# EasyEDA schematic SCH_Bike-Helmet-Turn-Signals_2024-05-09.json

## Sheets
1 Sheet_1: TITLE: Bike Side; REV: 1.0; Date: 2024-05-04; Sheet: 1/2; Drawn By: Zach Hennen; Company: UW Madison
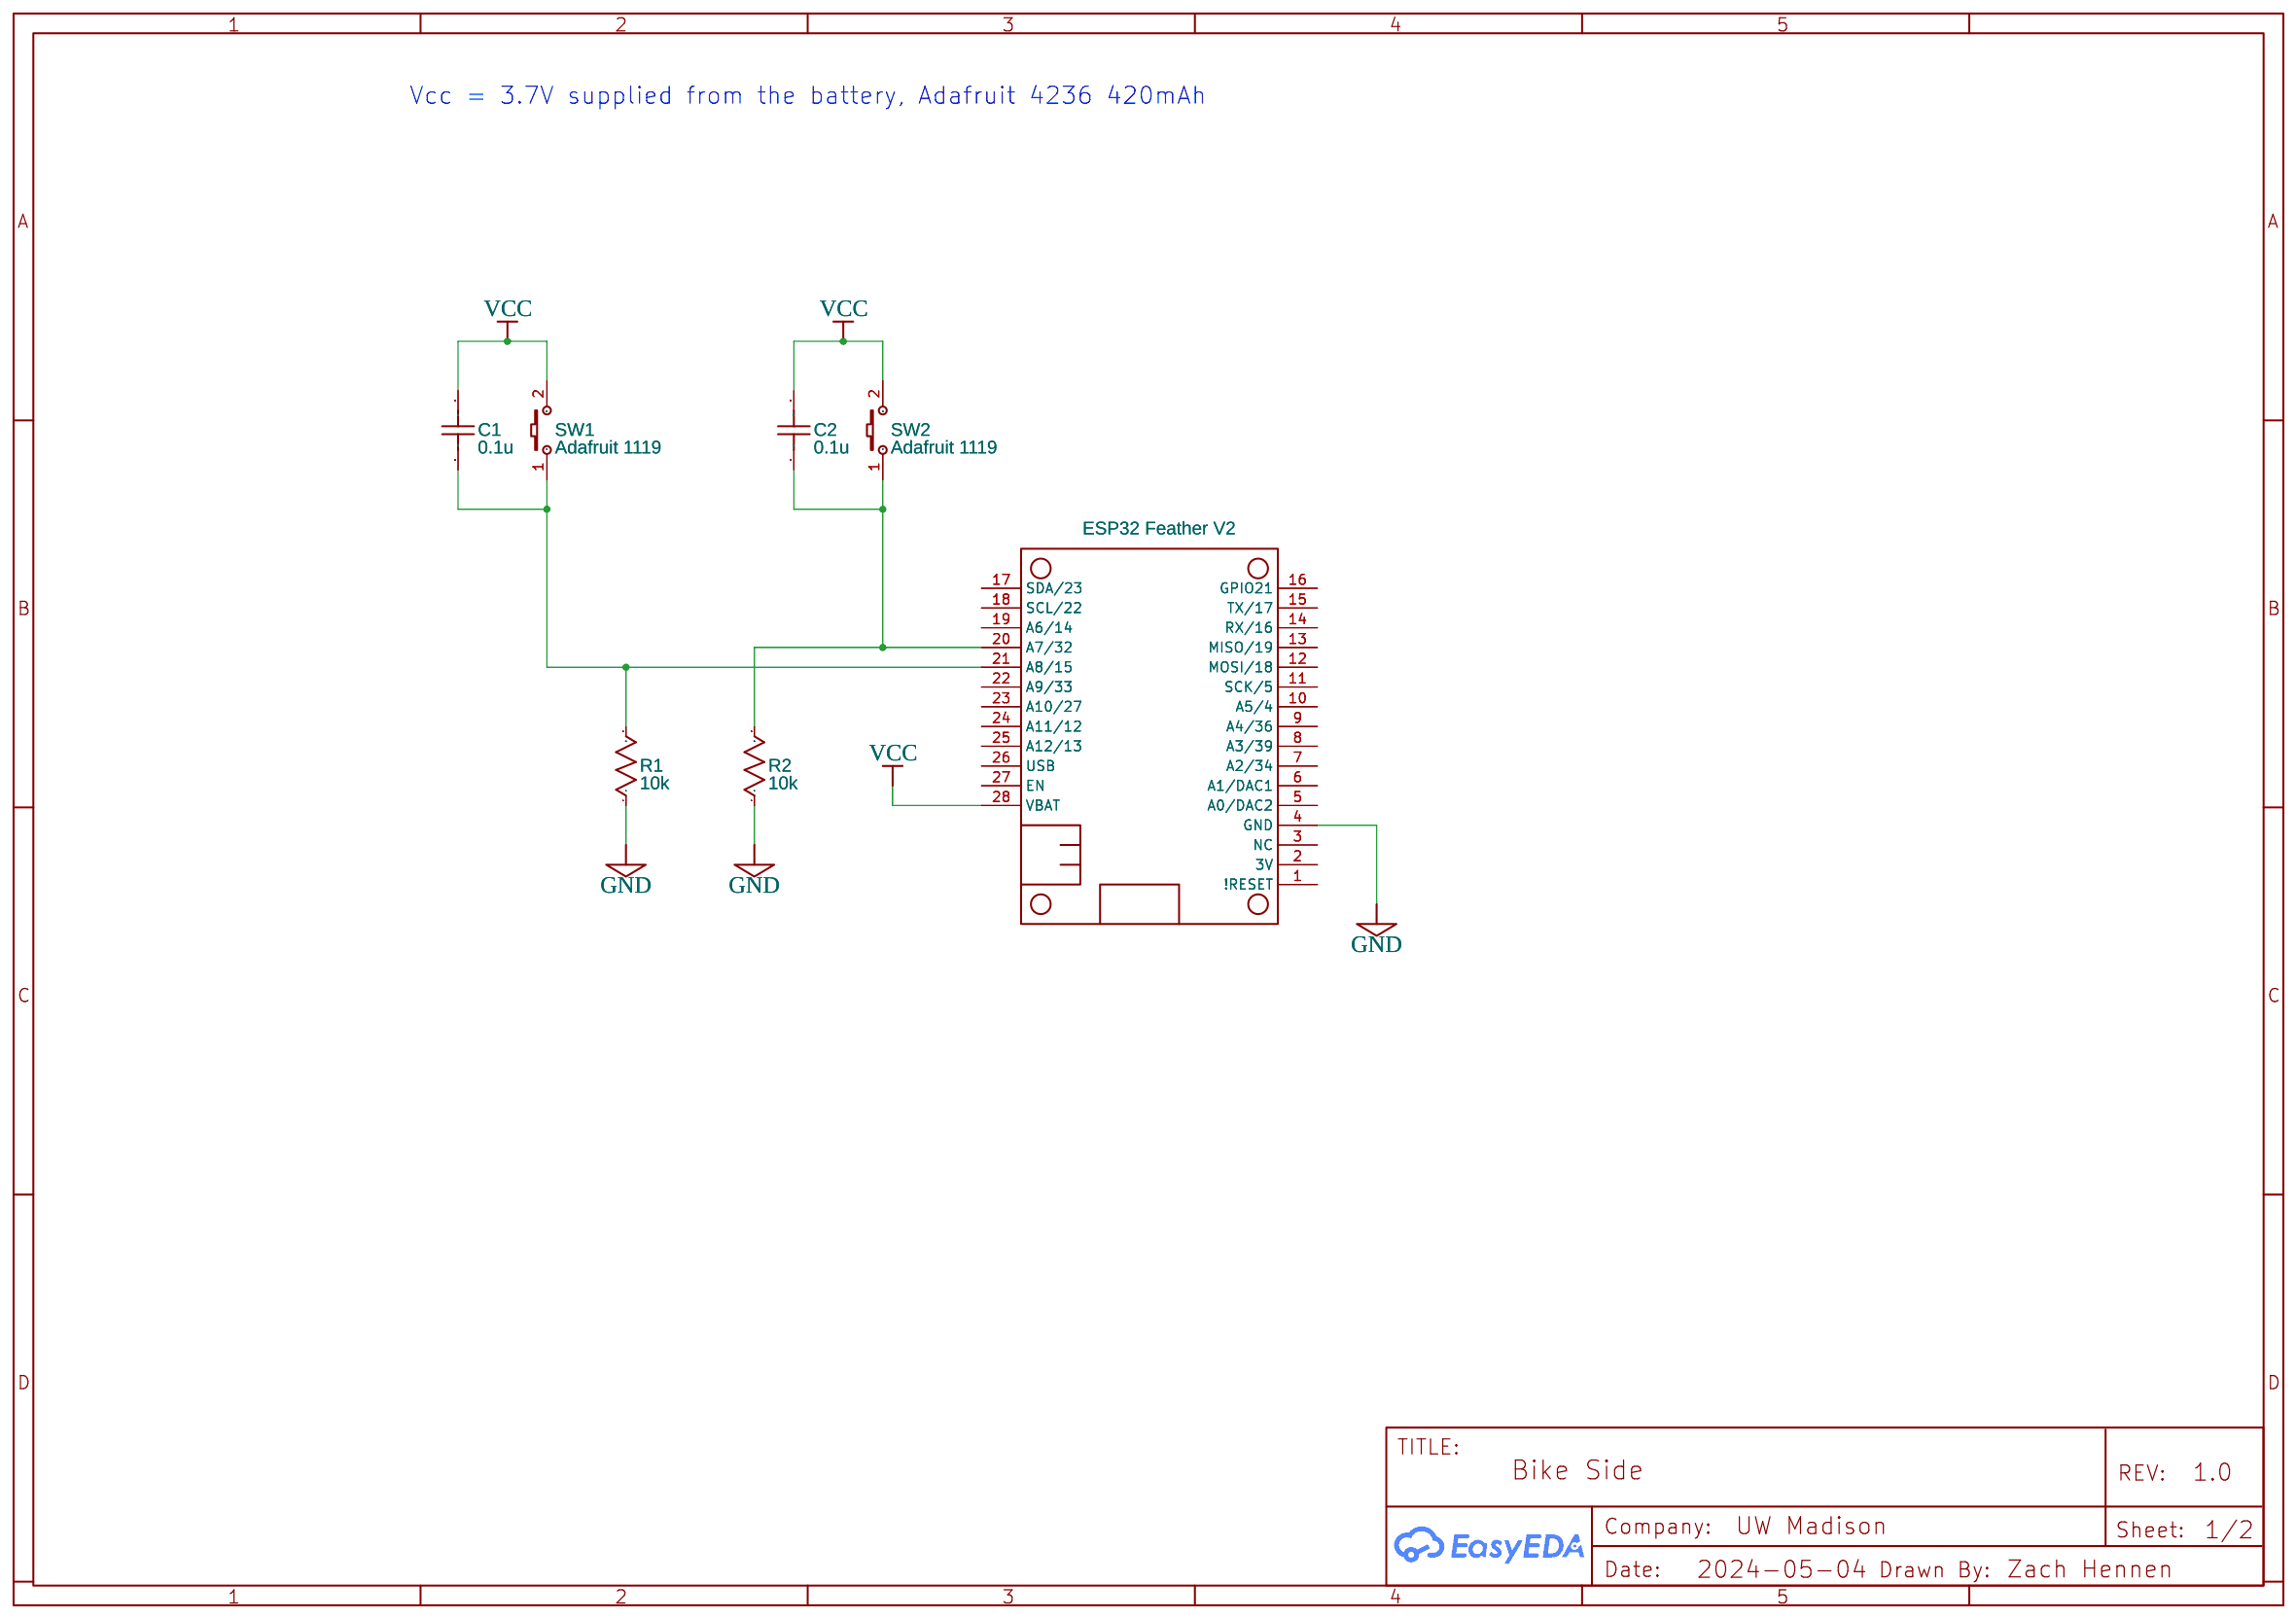
[diagram p0: Sheet_1]
2 Sheet_2: TITLE: Helmet Side; Date: 2024-05-06; Sheet: 2/2
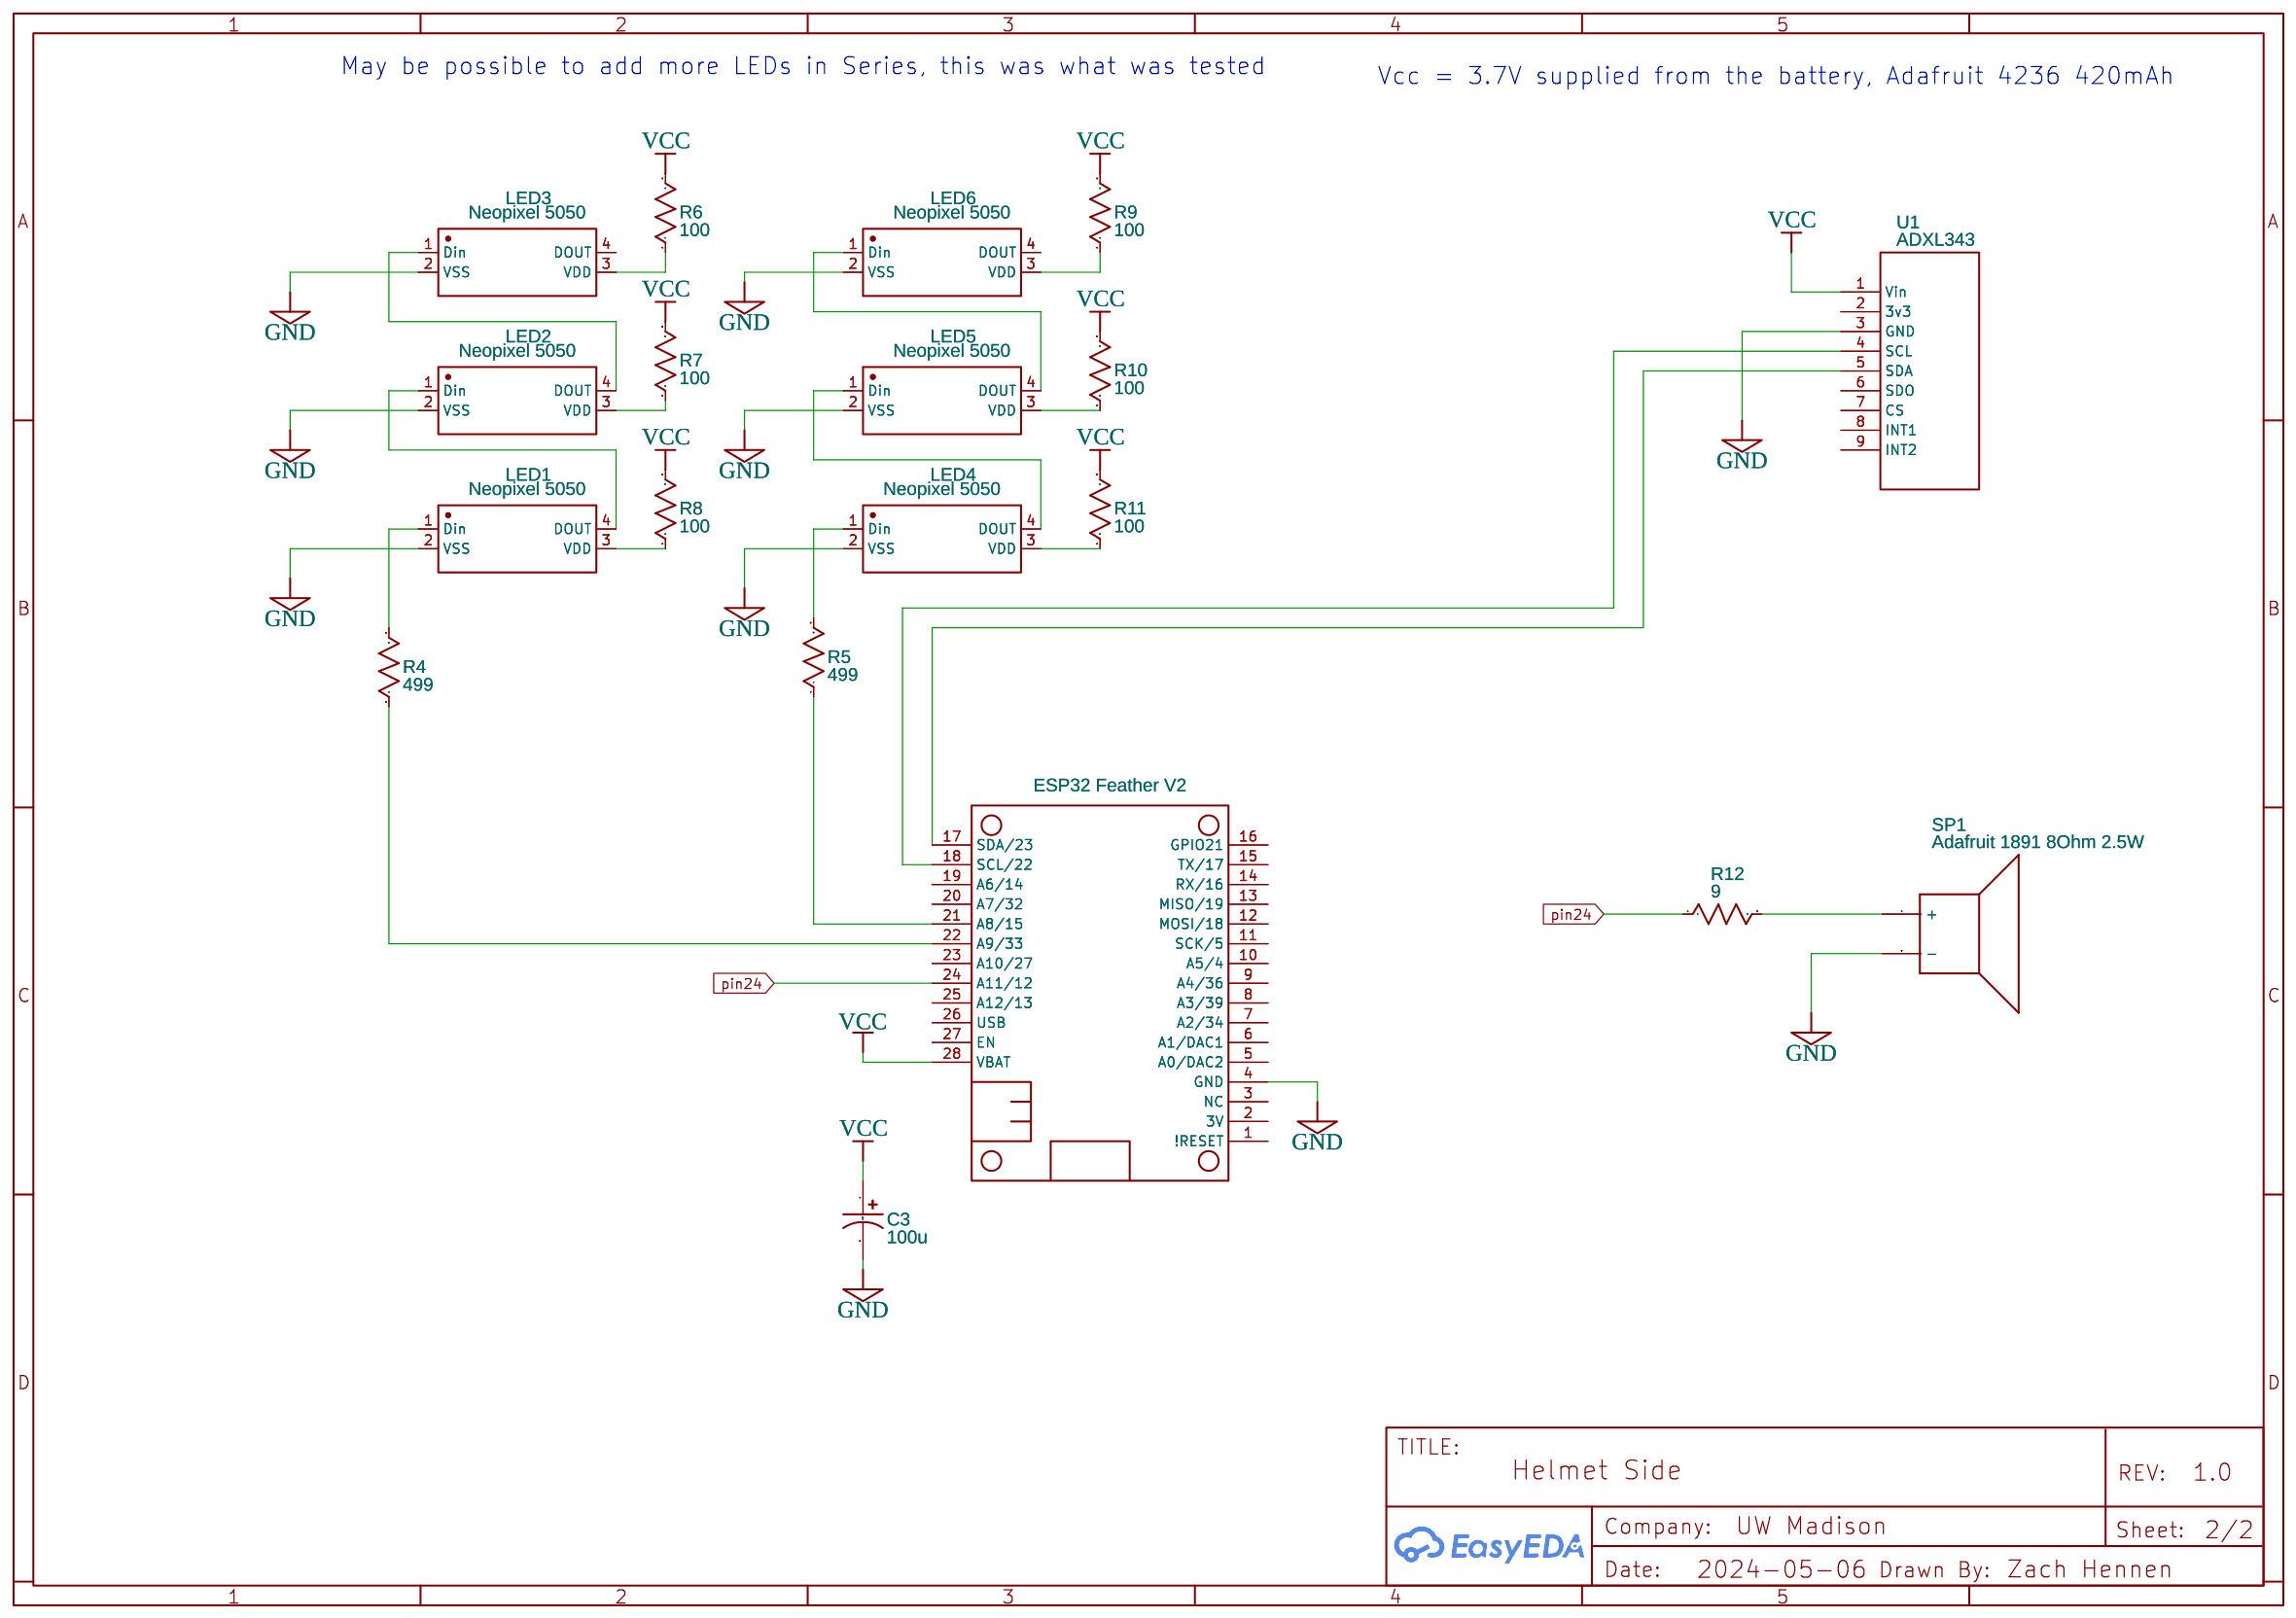
[diagram p1: Sheet_2]

## Parts
sheet Sheet_1
C1  0.1u  [C0603]
C2  0.1u  [C0603]
MS2  ESP32 Feather V2  [ADAFRUIT_HUZZAH32_MOUNT_0]
R1  10k  [R0603]
R2  10k  [R0603]
SW1  Adafruit 1119  [KEY-SMD_2P-L6.2-W3.6-LS8.0]
SW2  Adafruit 1119  [KEY-SMD_2P-L6.2-W3.6-LS8.0]
sheet Sheet_2
C3  100u  [CASE-A_3216]
LED1  Neopixel 5050  [ADAFRUIT 4 PIN 5050 RGB LED "NEOPIXEL"]
LED2  Neopixel 5050  [ADAFRUIT 4 PIN 5050 RGB LED "NEOPIXEL"]
LED3  Neopixel 5050  [ADAFRUIT 4 PIN 5050 RGB LED "NEOPIXEL"]
LED4  Neopixel 5050  [ADAFRUIT 4 PIN 5050 RGB LED "NEOPIXEL"]
LED5  Neopixel 5050  [ADAFRUIT 4 PIN 5050 RGB LED "NEOPIXEL"]
LED6  Neopixel 5050  [ADAFRUIT 4 PIN 5050 RGB LED "NEOPIXEL"]
MS1  ESP32 Feather V2  [ADAFRUIT_HUZZAH32_MOUNT_0]
R4  499  [R0603]
R5  499  [R0603]
R6  100  [R0603]
R7  100  [R0603]
R8  100  [R0603]
R9  100  [R0603]
R10  100  [R0603]
R11  100  [R0603]
R12  9  [R0603]
SP1  Adafruit 1891 8Ohm 2.5W  [SPEAKER]
U1  ADXL343  [ADXL343]

## Library data of the parts
C1 C2 = C_0603_US: Contributor: LCEDA_Lib
MS1 MS2 = Feather_HUZZAH32 small outline: sourceId: 0S0UN5Zhz; Contributor: robdobsn; Supplier Part: undefined; Supplier: Adafruit
R1 R2 R4-R12 = R_0603_US: Contributor: LCEDA_Lib
SW1 SW2 = K2-3.6×6.1_SMD: Supplier Part: C118141; Supplier: LCSC; Manufacturer Part: K2-1107ST-A4SW-06; Contributor: LCEDA_Lib; 制造商: 韩国韩荣
C3 = C_Tan_SMD_A_US: Contributor: LCEDA_Lib
LED1-LED6 = 5050
SP1 = SPEAKER: Contributor: kruemelmonsterxD
U1 = ADXL343: Contributor: aherrera1

## Nets
GND: C3.2 LED1.2(VSS) LED2.2(VSS) LED3.2(VSS) LED4.2(VSS) LED5.2(VSS) LED6.2(VSS) MS1.4(GND) MS2.4(GND) R1.1 R2.1 SP1.2(-) U1.3(GND)
VCC: C1.2 C2.2 C3.1 MS1.28(VBAT) MS2.28(VBAT) R6.2 R7.2 R8.2 R9.2 R10.2 R11.2 SW1.2 SW2.2 U1.1(Vin)
pin24: MS1.24(A11/12) R12.1
Net-(C1-1): C1.1 MS2.21(A8/15) R1.2 SW1.1
Net-(C2-1): C2.1 MS2.20(A7/32) R2.2 SW2.1
Net-(LED1-1): LED1.1(Din) R4.2
Net-(LED1-3): LED1.3(VDD) R8.1
Net-(LED1-4): LED1.4(DOUT) LED2.1(Din)
Net-(LED2-3): LED2.3(VDD) R7.1
Net-(LED2-4): LED2.4(DOUT) LED3.1(Din)
Net-(LED3-3): LED3.3(VDD) R6.1
Net-(LED4-1): LED4.1(Din) R5.2
Net-(LED4-3): LED4.3(VDD) R11.1
Net-(LED4-4): LED4.4(DOUT) LED5.1(Din)
Net-(LED5-3): LED5.3(VDD) R10.1
Net-(LED5-4): LED5.4(DOUT) LED6.1(Din)
Net-(LED6-3): LED6.3(VDD) R9.1
Net-(MS1-17): MS1.17(SDA/23) U1.5(SDA)
Net-(MS1-18): MS1.18(SCL/22) U1.4(SCL)
Net-(MS1-21): MS1.21(A8/15) R5.1
Net-(MS1-22): MS1.22(A9/33) R4.1
Net-(R12-2): R12.2 SP1.1(+)

Not connected (* = marked no-connect by the designer): LED3 4(DOUT); LED6 4(DOUT); MS1 1(!RESET) 2(3V) 3(NC) 5(A0/DAC2) 6(A1/DAC1) 7(A2/34) 8(A3/39) 9(A4/36) 10(A5/4) 11(SCK/5) 12(MOSI/18) 13(MISO/19) 14(RX/16) 15(TX/17) 16(GPIO21) 19(A6/14) 20(A7/32) 23(A10/27) 25(A12/13) 26(USB) 27(EN); MS2 1(!RESET) 2(3V) 3(NC) 5(A0/DAC2) 6(A1/DAC1) 7(A2/34) 8(A3/39) 9(A4/36) 10(A5/4) 11(SCK/5) 12(MOSI/18) 13(MISO/19) 14(RX/16) 15(TX/17) 16(GPIO21) 17(SDA/23) 18(SCL/22) 19(A6/14) 22(A9/33) 23(A10/27) 24(A11/12) 25(A12/13) 26(USB) 27(EN); U1 2(3v3) 6(SDO) 7(CS) 8(INT1) 9(INT2)

## Notes on the sheets
sheet 1
- Vcc = 3.7V supplied from the battery, Adafruit 4236 420mAh
sheet 2
- May be possible to add more LEDs in Series, this was what was tested
- Vcc = 3.7V supplied from the battery, Adafruit 4236 420mAh
